# Altium schematic sheet Sheet1.SchDoc
size A0; SheetNumber: 1; SheetTotal: 1
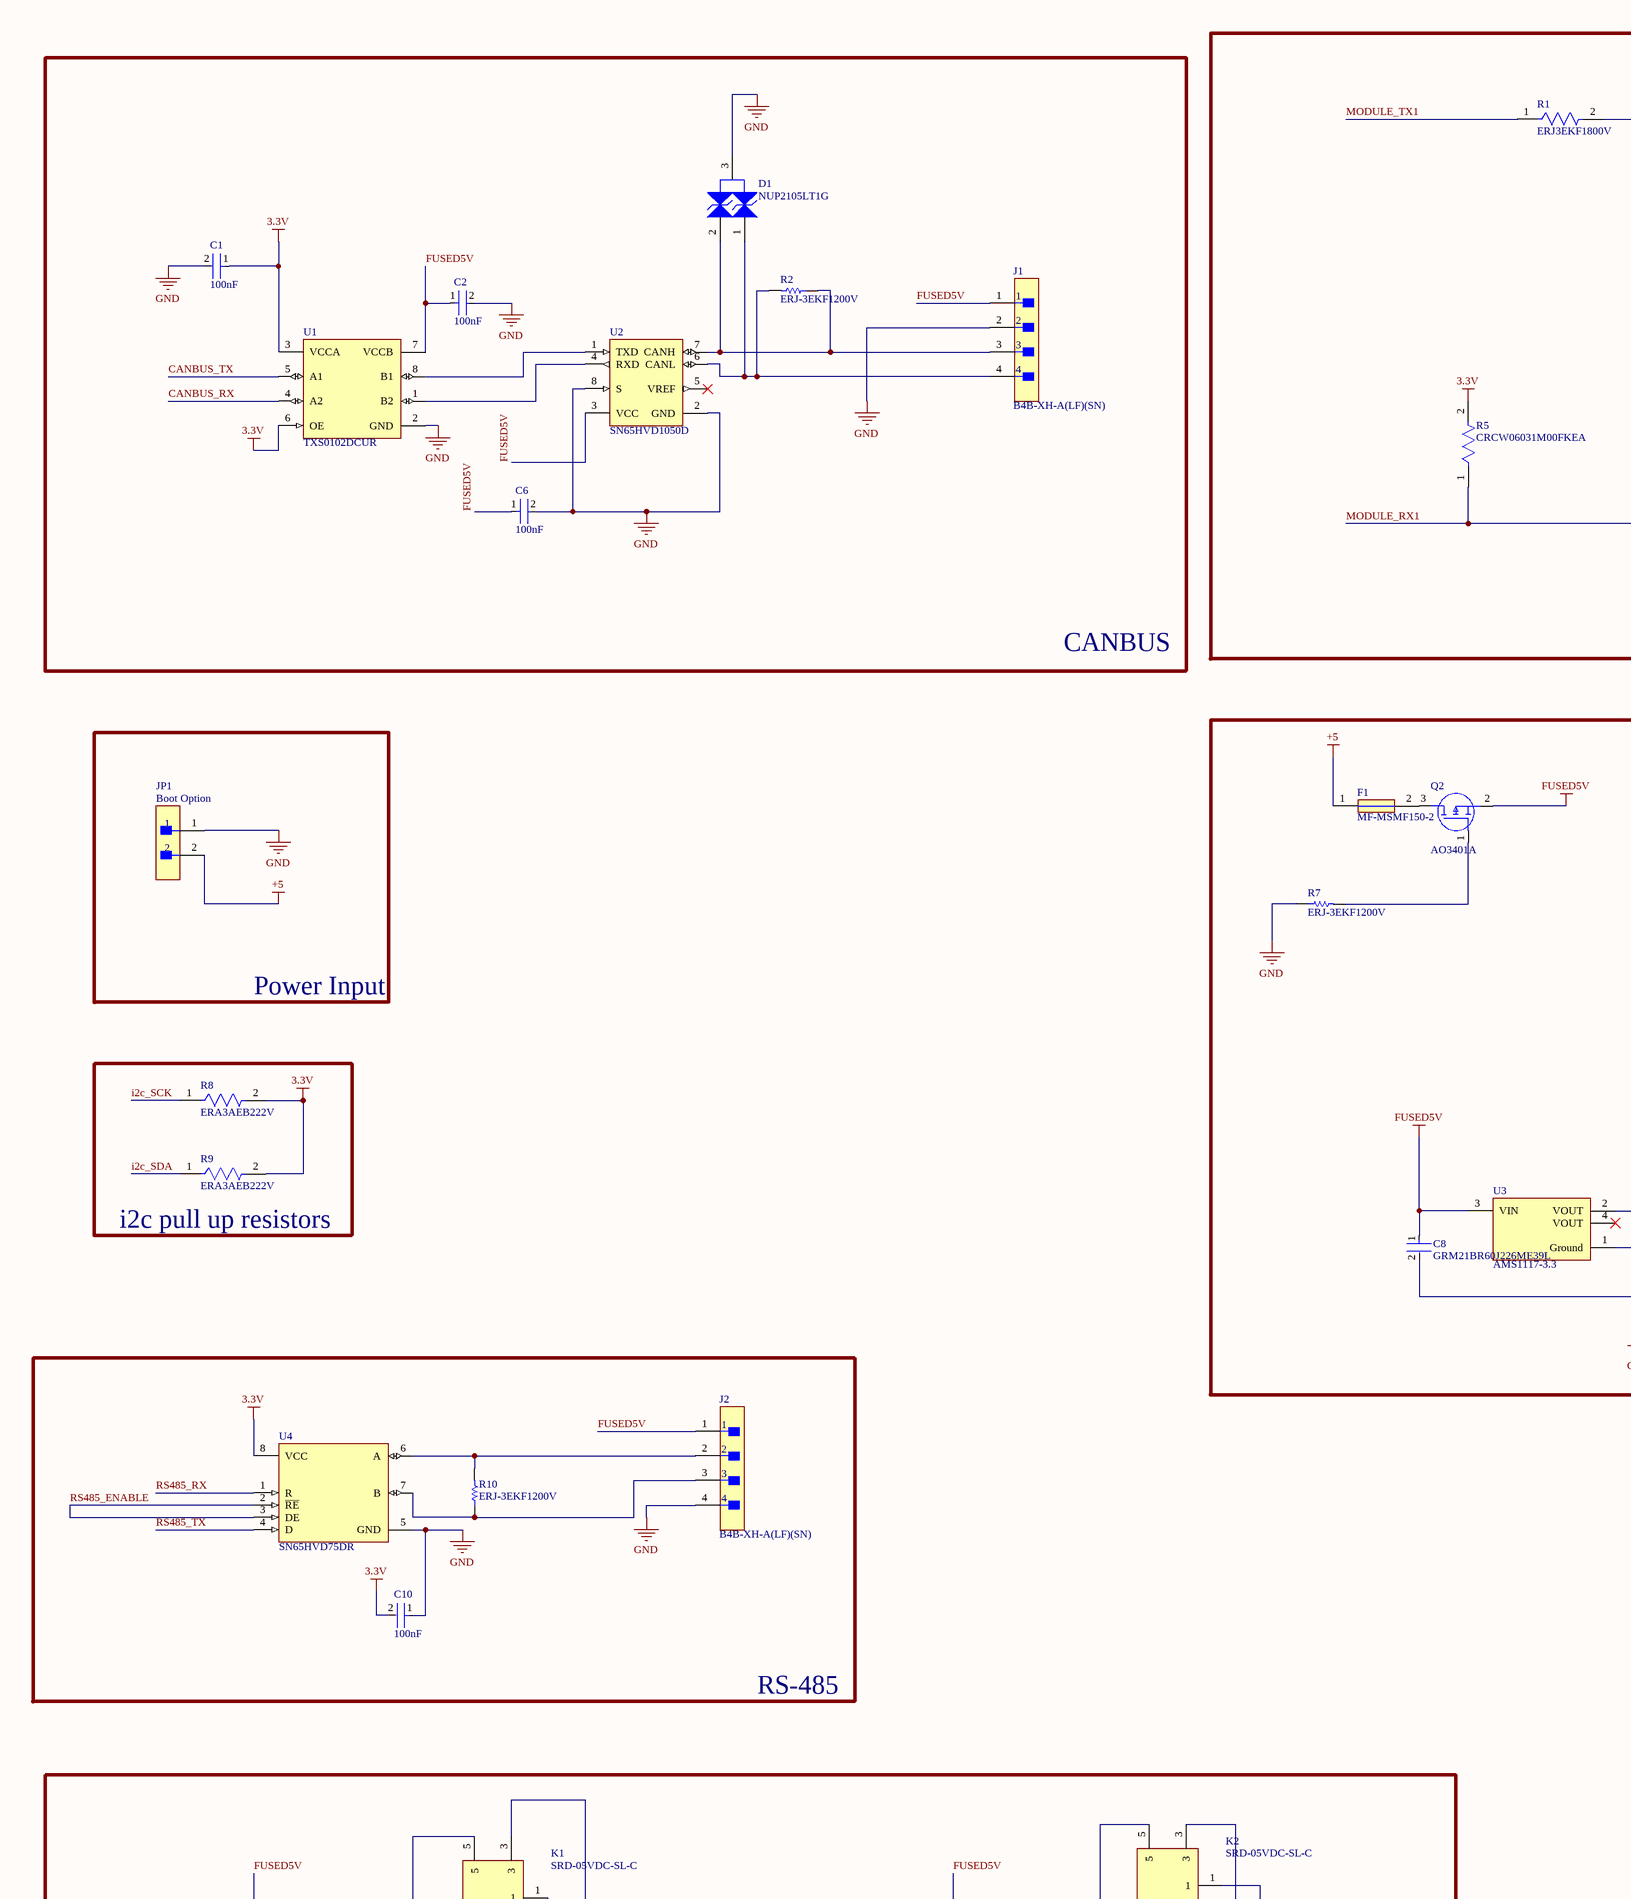
[diagram p0: Sheet1.SchDoc, top left]
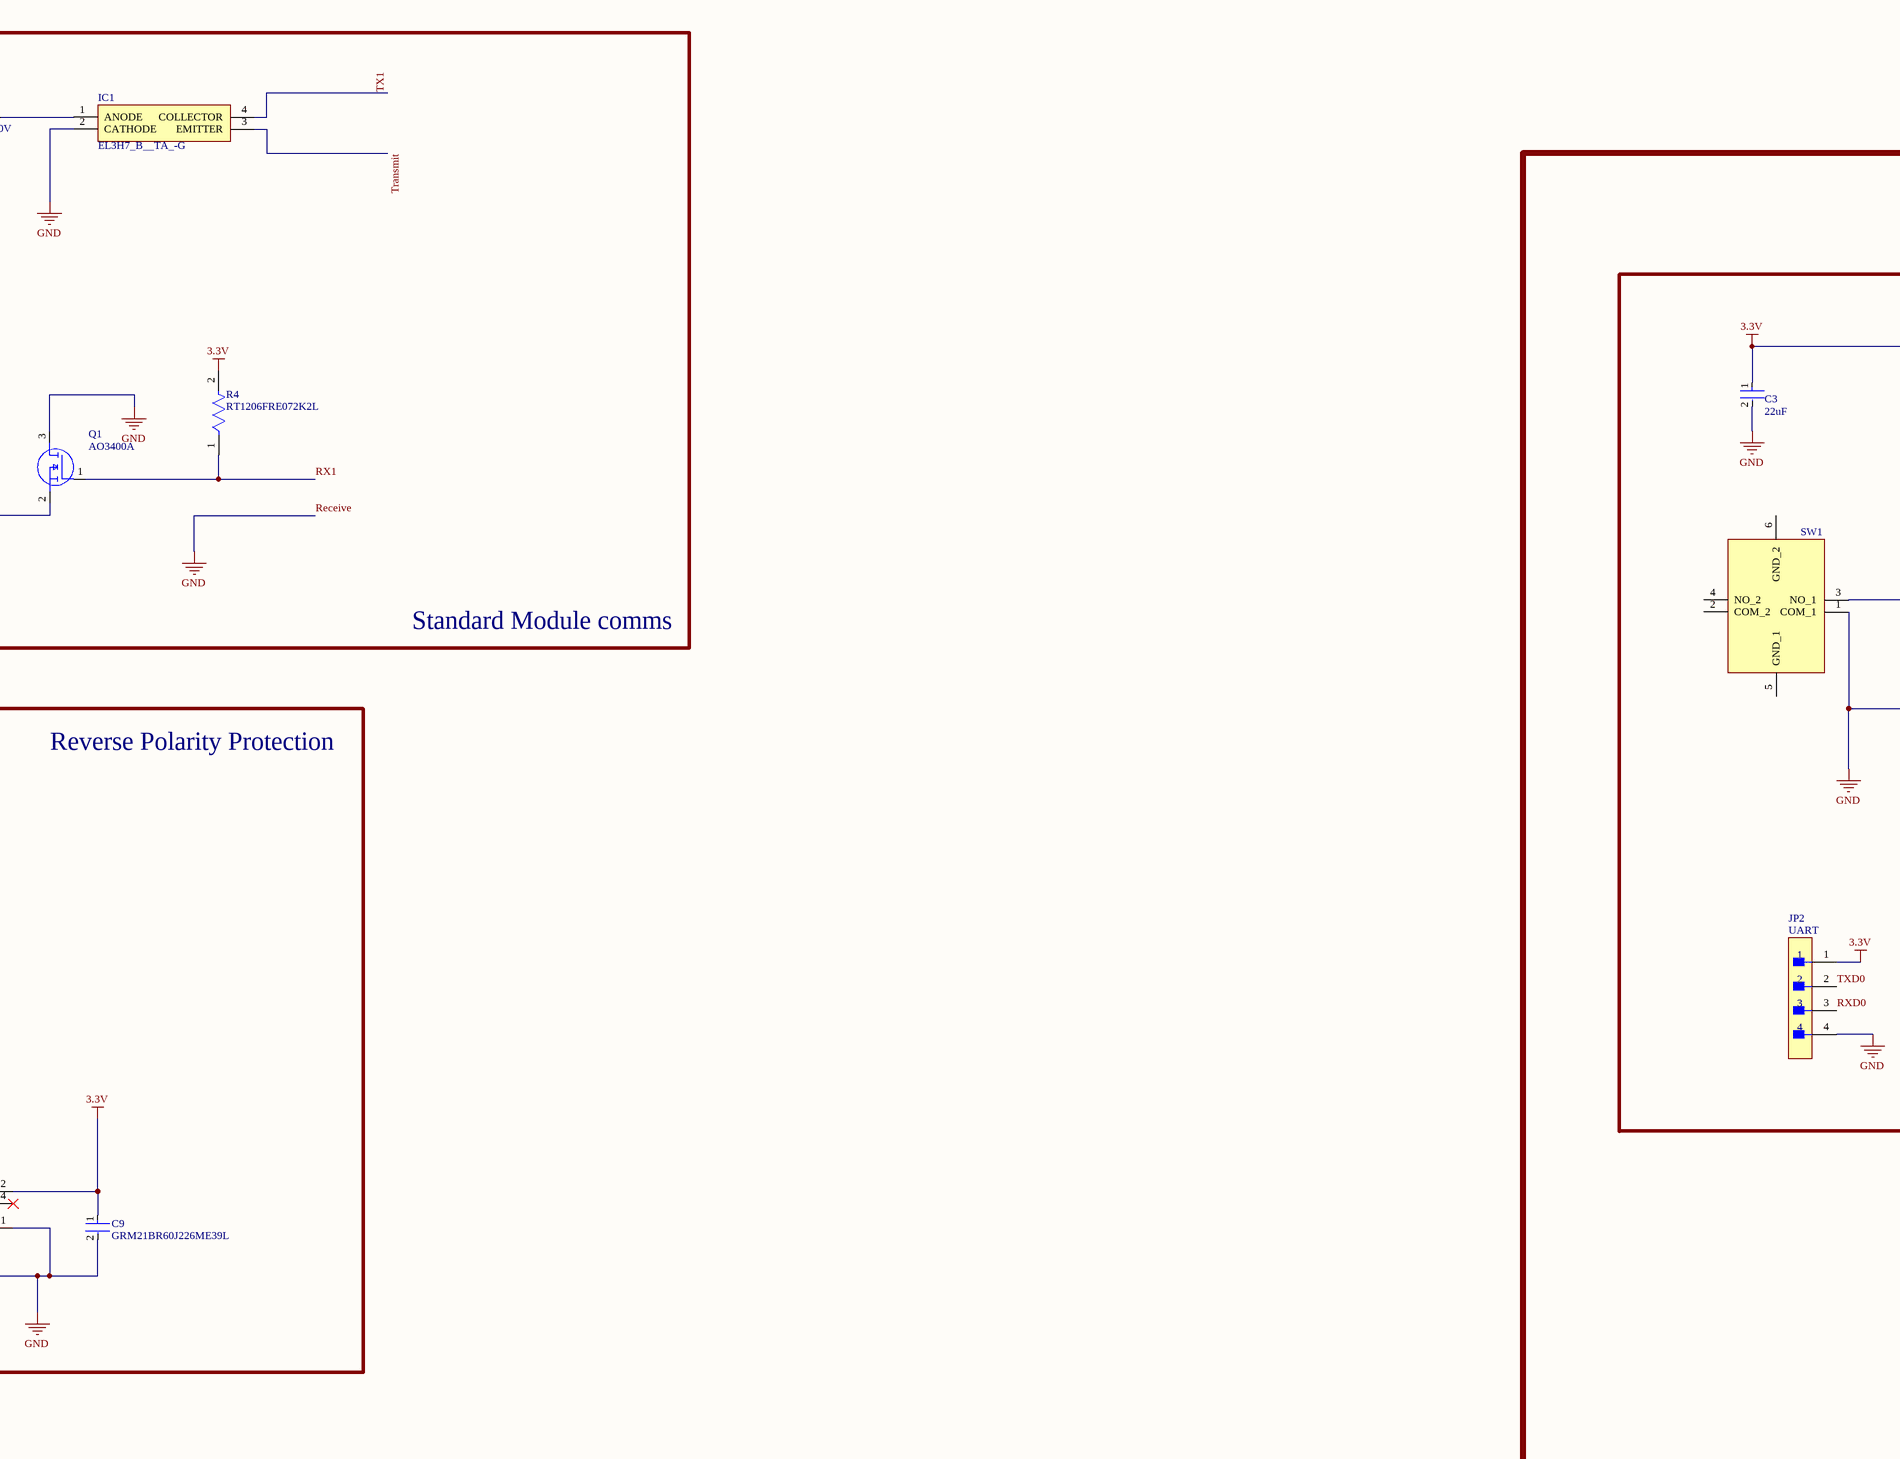
[diagram p1: Sheet1.SchDoc, top middle]
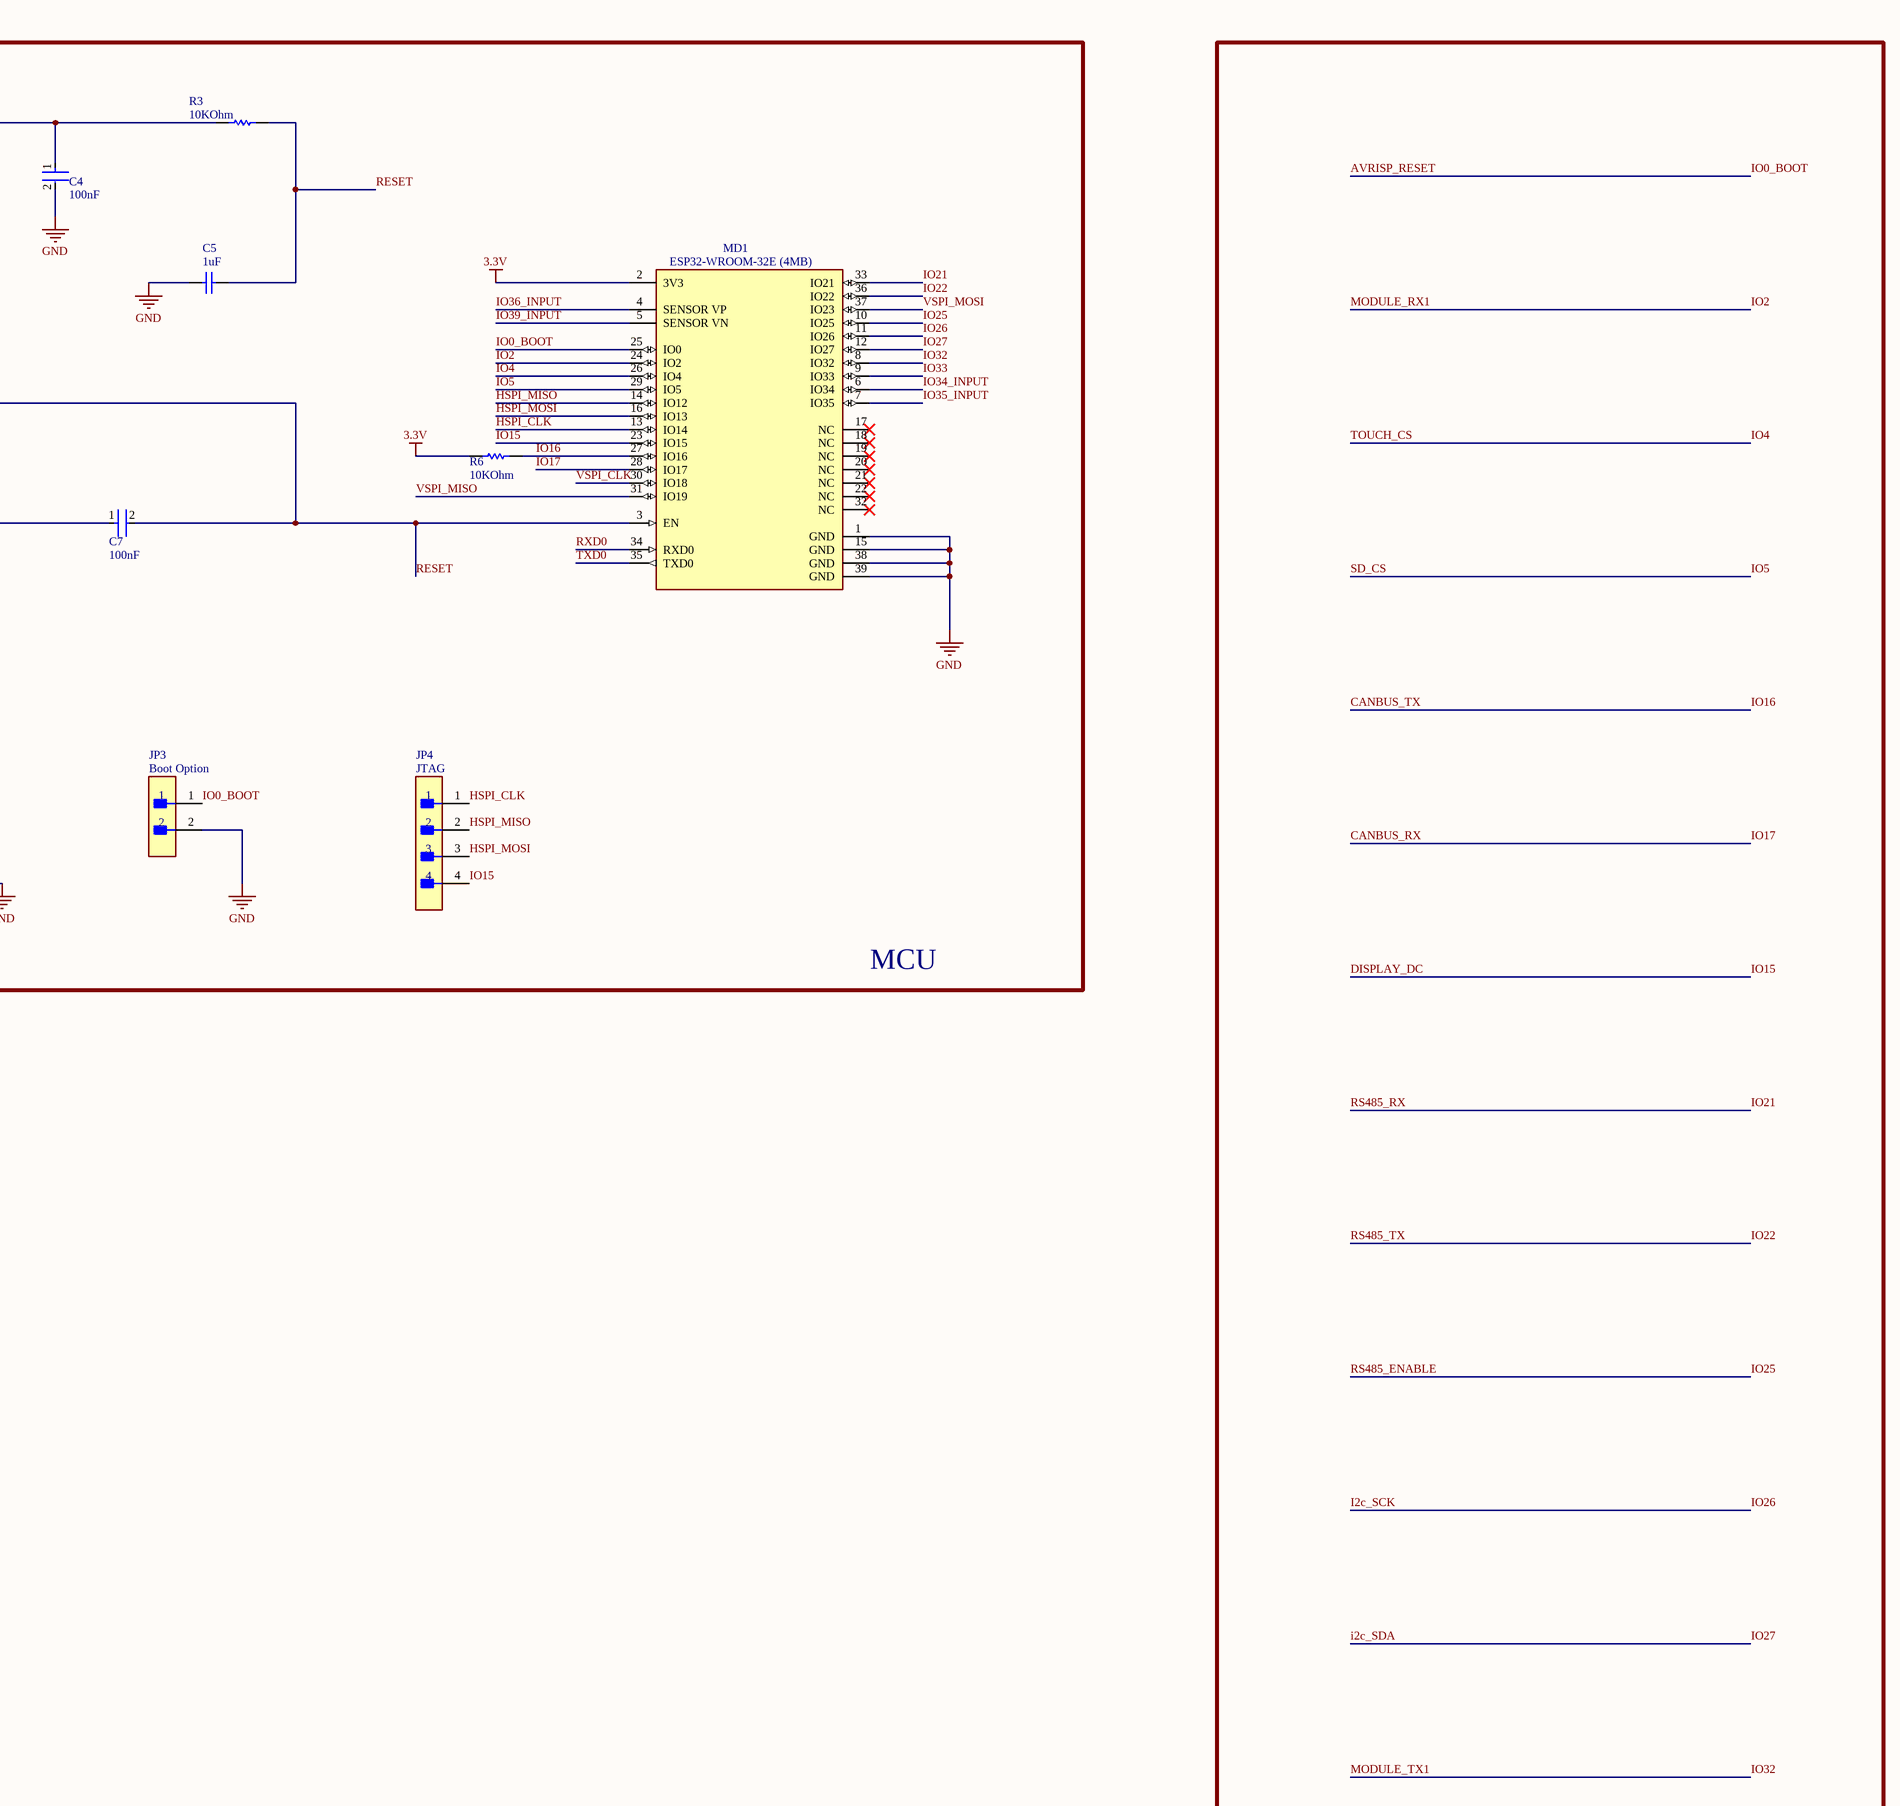
[diagram p2: Sheet1.SchDoc, top right]
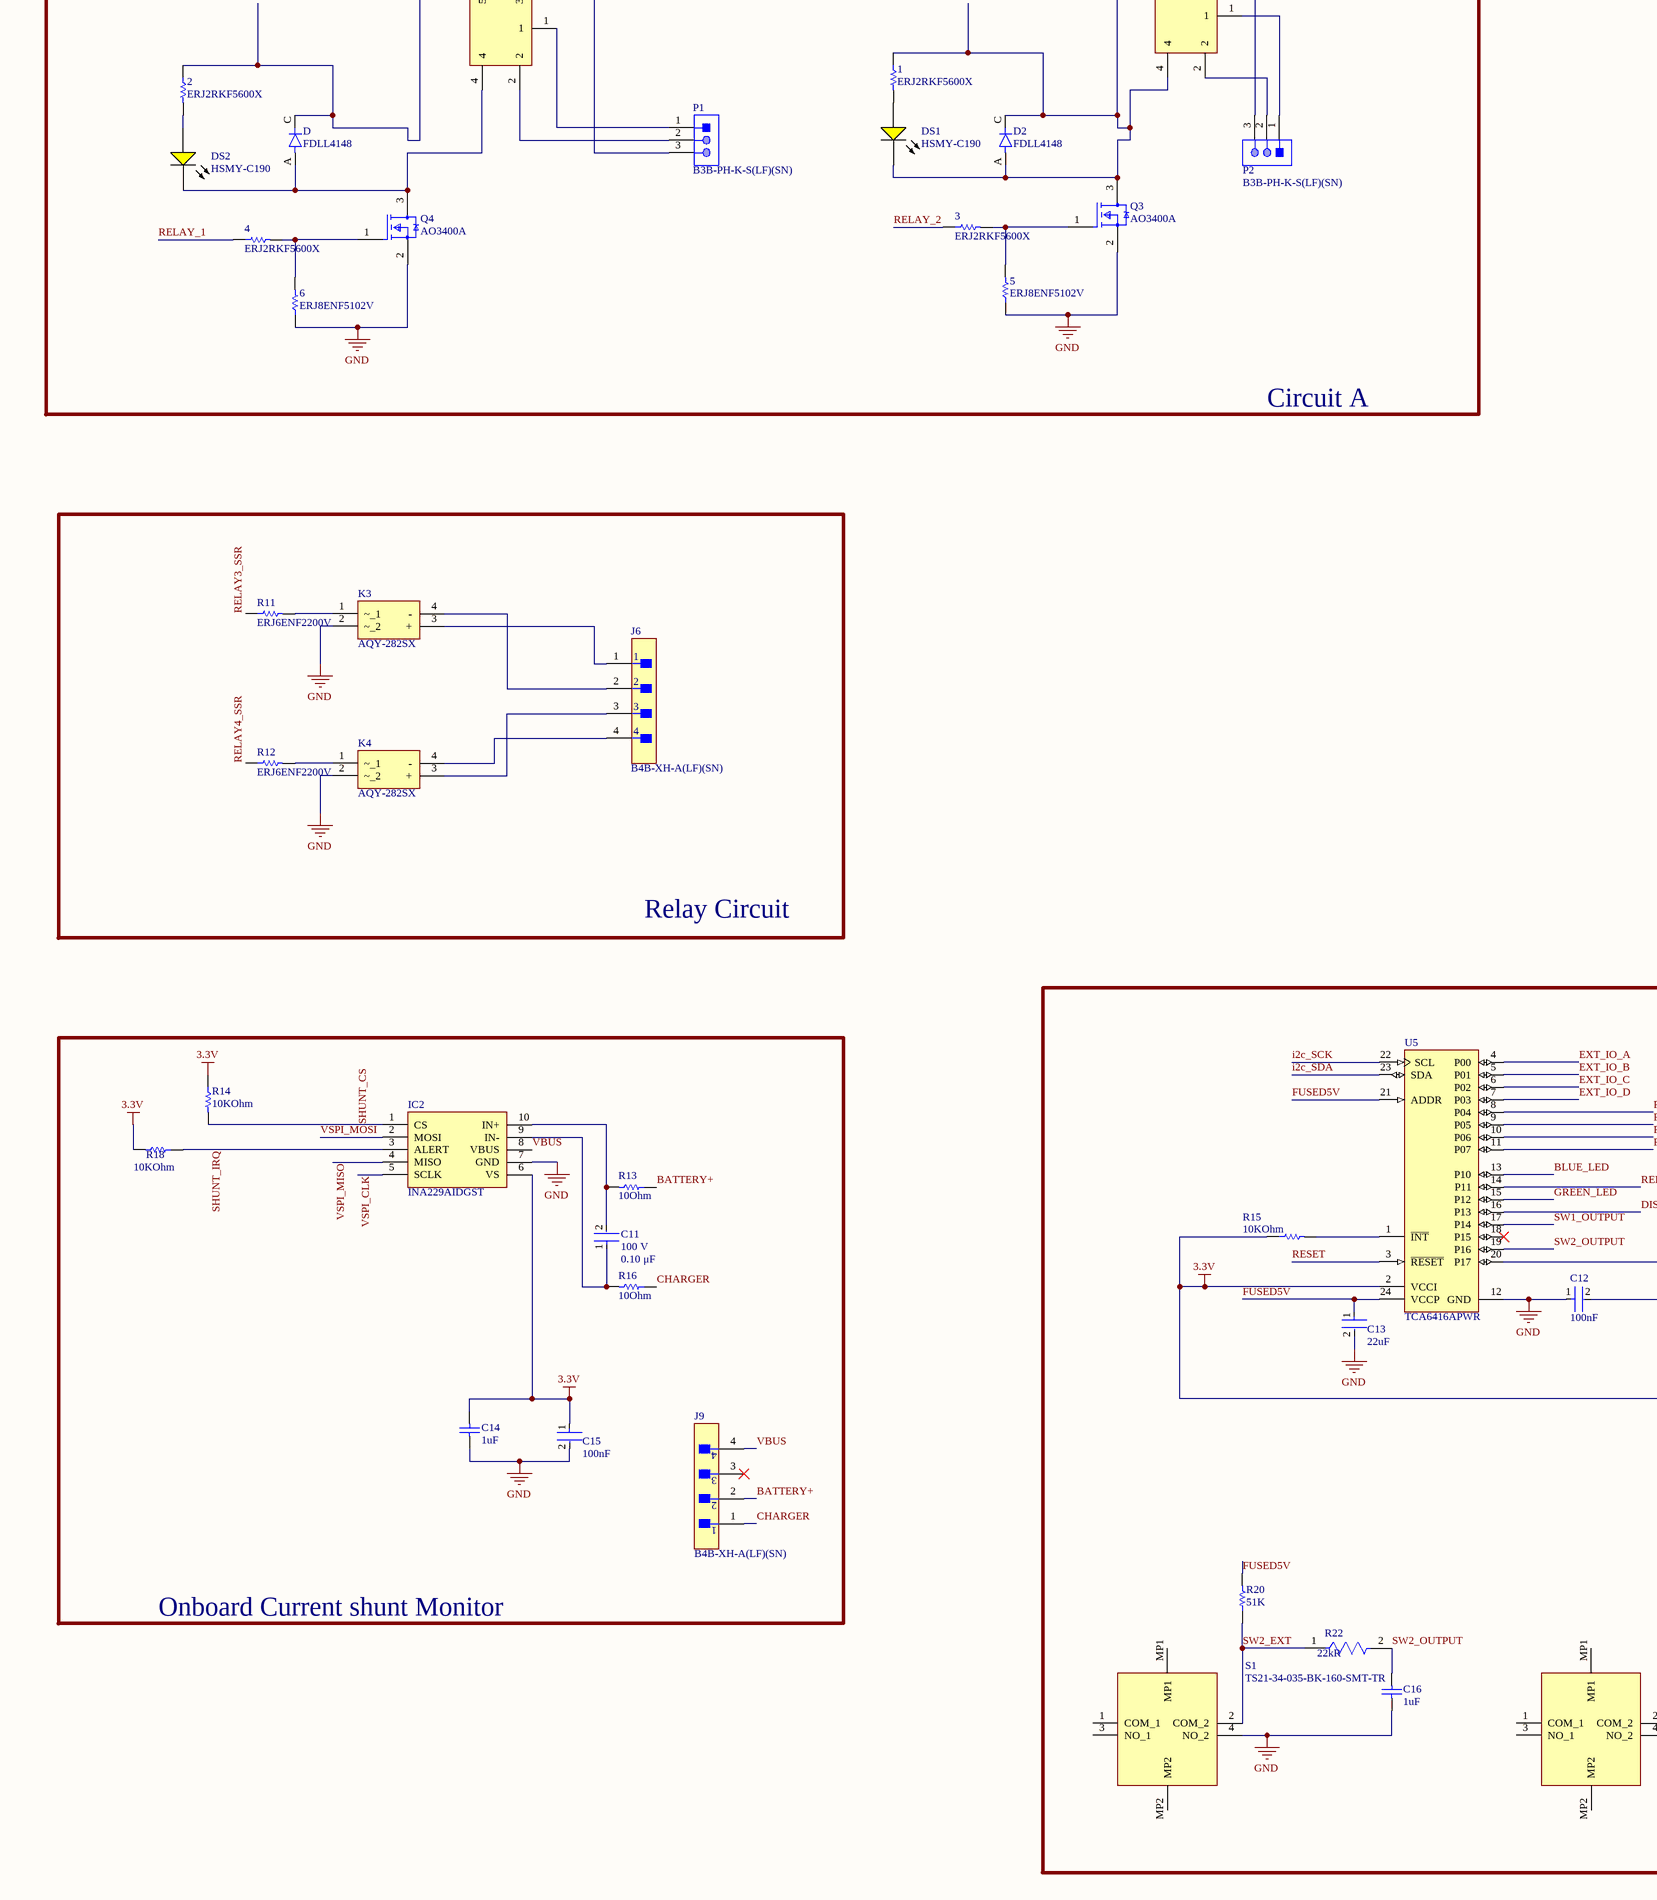
[diagram p3: Sheet1.SchDoc, bottom left]
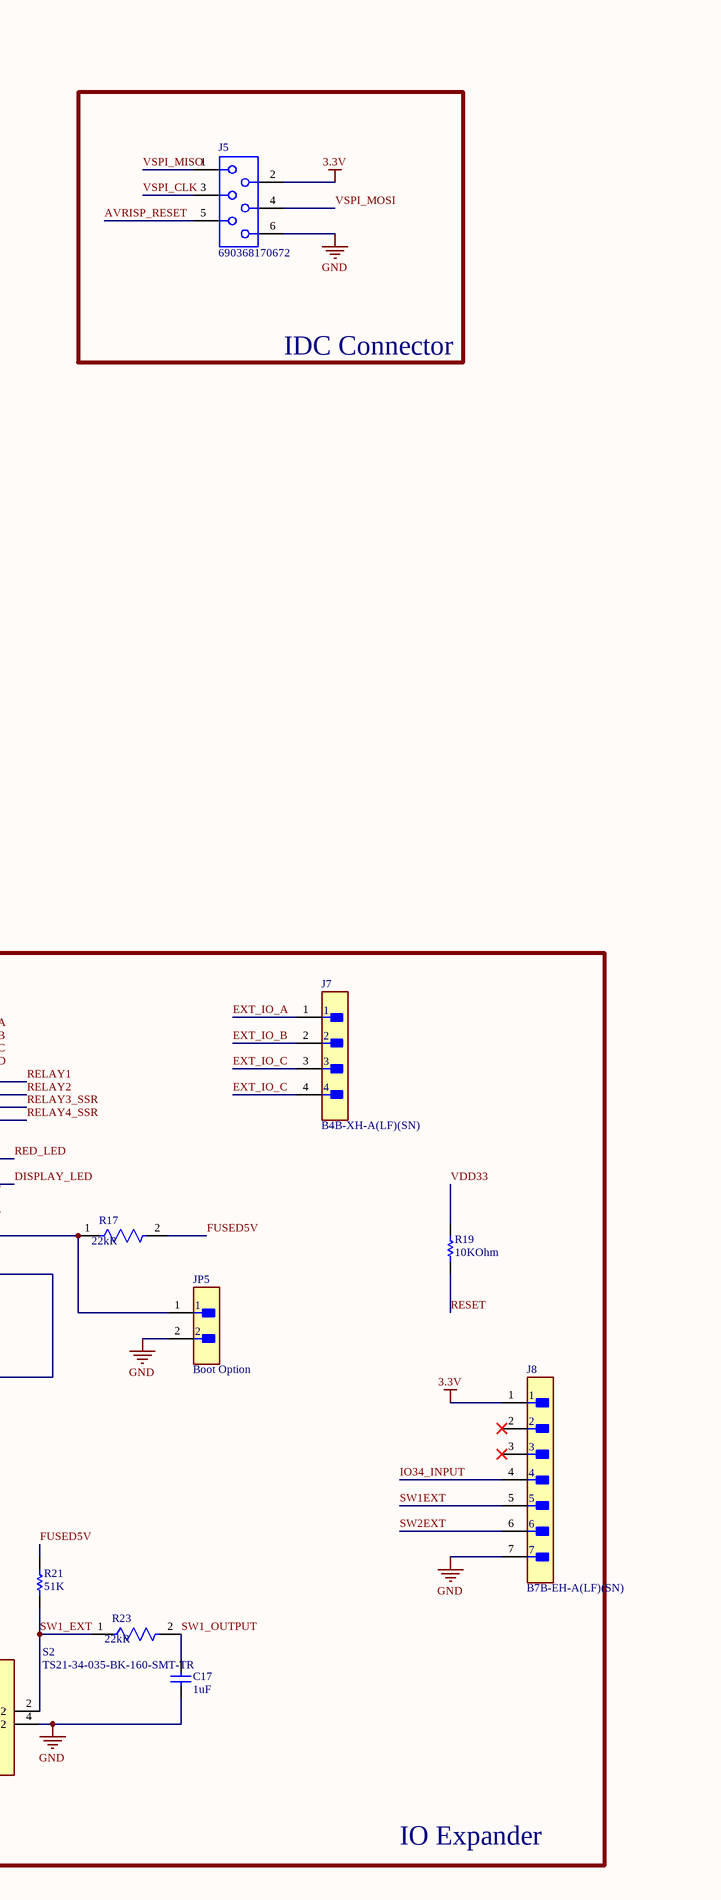
[diagram p4: Sheet1.SchDoc, bottom middle]
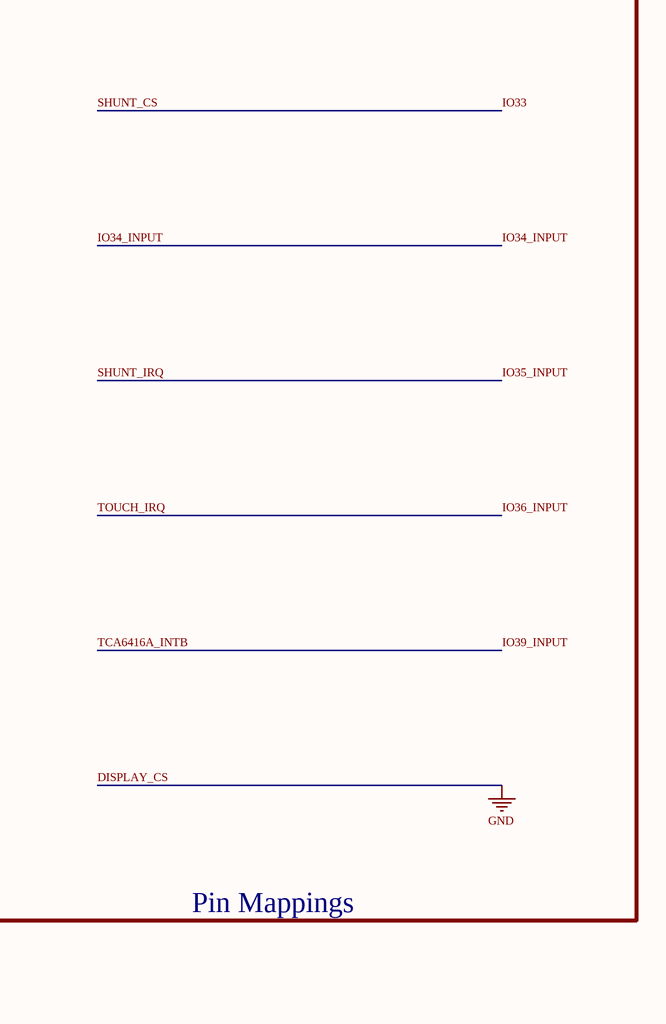
[diagram p5: Sheet1.SchDoc, bottom right]

## Parts
1  ERJ2RKF5600X  [RESC1005X40X25LL05T05]
2  ERJ2RKF5600X  [RESC1005X40X25LL05T05]
3  ERJ2RKF5600X  [RESC1005X40X25LL05T05]
4  ERJ2RKF5600X  [RESC1005X40X25LL05T05]
5  ERJ8ENF5102V  [RESC3216X70X50NL05T20]
6  ERJ8ENF5102V  [RESC3216X70X50NL05T20]
C1  Capacitance: 100nF  [FP-GRM033-0_03-IPC_C]  (hidden comment: GRM033R61A104KE15D)
C2  Capacitance: 100nF  [FP-GRM033-0_03-IPC_C]  (hidden comment: GRM033R61A104KE15D)
C3  Capacitance: 22uF  [FP-GRM21B-0_15-MFG]  (hidden comment: GRM21BR60J226ME39L)
C4  Capacitance: 100nF  [FP-GRM033-0_03-IPC_C]  (hidden comment: GRM033R61A104KE15D)
C5  Capacitance: 1uF  [CAPC2013X145X50LL20T25]  (hidden comment: C0805C105K4PACTU)
C6  Capacitance: 100nF  [FP-GRM033-0_03-IPC_C]  (hidden comment: GRM033R61A104KE15D)
C7  Capacitance: 100nF  [FP-GRM033-0_03-IPC_C]  (hidden comment: GRM033R61A104KE15D)
C8  GRM21BR60J226ME39L  [FP-GRM21B-0_15-MFG]
C9  GRM21BR60J226ME39L  [FP-GRM21B-0_15-MFG]
C10  Capacitance: 100nF  [FP-GRM033-0_03-IPC_C]  (hidden comment: GRM033R61A104KE15D)
C11  Voltage Rating: 100 V  Capacitance: 0.10 μF  [FP-C1206C-EB-MFG]  (hidden comment: C1206C104K1RACTU)
C12  Capacitance: 100nF  [FP-GRM033-0_03-IPC_C]  (hidden comment: GRM033R61A104KE15D)
C13  Capacitance: 22uF  [FP-GRM21B-0_15-MFG]  (hidden comment: GRM21BR60J226ME39L)
C14  Capacitance: 1uF  [CAPC2013X145X50LL20T25]  (hidden comment: C0805C105K4PACTU)
C15  Capacitance: 100nF  [FP-GRM033-0_03-IPC_C]  (hidden comment: GRM033R61A104KE15D)
C16  Capacitance: 1uF  [CAPC2013X145X50LL20T25]  (hidden comment: C0805C105K4PACTU)
C17  Capacitance: 1uF  [CAPC2013X145X50LL20T25]  (hidden comment: C0805C105K4PACTU)
D  FDLL4148  [DIOMELF3414N]
D1  NUP2105LT1G  [ONSC-SOT-23-3-318-08_V]
D2  FDLL4148  [DIOMELF3414N]
DS1  HSMY-C190  [AVAG-HSMX-C190_V]
DS2  HSMY-C190  [AVAG-HSMX-C190_V]
F1  MF-MSMF150-2  [FUSC4632X85N]
IC1  EL3H7_B__TA_-G  [SOIC127P700X200-4N]
IC2  INA229AIDGST  [SOP50P490X110-10N]
J1  B4B-XH-A(LF)(SN)  [FP-B4B-XH-A_LF_SN-MFG]
J2  B4B-XH-A(LF)(SN)  [FP-B4B-XH-A_LF_SN-MFG]
J5  690368170672  [690368170672]
J6  B4B-XH-A(LF)(SN)  [FP-B4B-XH-A_LF_SN-MFG]
J7  B4B-XH-A(LF)(SN)  [FP-B4B-XH-A_LF_SN-MFG]
J8  B7B-EH-A(LF)(SN)  [FP-B7B-EH-A_LF_SN-MFG]
J9  B4B-XH-A(LF)(SN)  [FP-B4B-XH-A_LF_SN-MFG]
JP1  Purpose: Boot Option  [FP-B2B-XH-A_LF_SN-MFG]  (hidden comment: B2B-XH-A(LF)(SN))
JP2  Purpose: UART  [FP-B4B-XH-A_LF_SN-MFG]  (hidden comment: B4B-XH-A(LF)(SN))
JP3  Purpose: Boot Option  [FP-B2B-XH-A_LF_SN-MFG]  (hidden comment: B2B-XH-A(LF)(SN))
JP4  Purpose: JTAG  [FP-B4B-XH-A_LF_SN-MFG]  (hidden comment: B4B-XH-A(LF)(SN))
JP5  Purpose: Boot Option  [FP-B2B-XH-A_LF_SN-MFG]  (hidden comment: B2B-XH-A(LF)(SN))
K1  SRD-05VDC-SL-C  [SRD]
K2  SRD-05VDC-SL-C  [SRD]
K3  AQY-282SX  [SOP254P680X230-4N]
K4  AQY-282SX  [SOP254P680X230-4N]
MD1  ESP32-WROOM-32E (4MB)  [FP-ESP32-WROOM-32E_4MB-MFG]
P1  B3B-PH-K-S(LF)(SN)  [JST-B3B-PH-K-S-3_V]
P2  B3B-PH-K-S(LF)(SN)  [JST-B3B-PH-K-S-3_V]
Q1  AO3400A  [SOT95P280X125-3N]
Q2  AO3401A  [SOT95P280X125-3N]
Q3  AO3400A  [FP-SOT23-MFG]
Q4  AO3400A  [FP-SOT23-MFG]
R1  ERJ3EKF1800V  [FP-ERJ3EK-MFG]
R2  ERJ-3EKF1200V  [RESC1609X55X30ML15T15]
R3  Resistance: 10KOhm  [RESC1005X40X25LL05T05]  (hidden comment: ERJ2RKF1002X)
R4  RT1206FRE072K2L  [FP-RT1206-MFG]
R5  CRCW06031M00FKEA  [FP-CRCW0603-e3-IPC_A]
R6  Resistance: 10KOhm  [RESC1005X40X25LL05T05]  (hidden comment: ERJ2RKF1002X)
R7  ERJ-3EKF1200V  [RESC1609X55X30ML15T15]
R8  ERA3AEB222V  [FP-ERA3A-IPC_B]
R9  ERA3AEB222V  [FP-ERA3A-IPC_B]
R10  ERJ-3EKF1200V  [RESC1609X55X30ML15T15]
R11  ERJ6ENF2200V  [RESC2013X70X40NL20T20]
R12  ERJ6ENF2200V  [RESC2013X70X40NL20T20]
R13  Resistance: 10Ohm  [RESC3225X70X50LL20T20]  (hidden comment: ERJ-14NF10R0U)
R14  Resistance: 10KOhm  [RESC1005X40X25LL05T05]  (hidden comment: ERJ2RKF1002X)
R15  Resistance: 10KOhm  [RESC1005X40X25LL05T05]  (hidden comment: ERJ2RKF1002X)
R16  Resistance: 10Ohm  [RESC3225X70X50LL20T20]  (hidden comment: ERJ-14NF10R0U)
R17  Resistance: 22kR  [FP-ERA3A-MFG]  (hidden comment: ERA-3AEB223V)
R18  Resistance: 10KOhm  [RESC1005X40X25LL05T05]  (hidden comment: ERJ2RKF1002X)
R19  Resistance: 10KOhm  [RESC1005X40X25LL05T05]  (hidden comment: ERJ2RKF1002X)
R20  Resistance: 51K  [RESC1608X55X30NL15T15]  (hidden comment: ERJ-3GEYJ513V)
R21  Resistance: 51K  [RESC1608X55X30NL15T15]  (hidden comment: ERJ-3GEYJ513V)
R22  Resistance: 22kR  [FP-ERA3A-MFG]  (hidden comment: ERA-3AEB223V)
R23  Resistance: 22kR  [FP-ERA3A-MFG]  (hidden comment: ERA-3AEB223V)
S1  TS21-34-035-BK-160-SMT-TR  [TS2134035BK160SMTTR]
S2  TS21-34-035-BK-160-SMT-TR  [TS2134035BK160SMTTR]
SW1  PTS526SMG20SMTR21_LFS  [PTS526SMG20SMTR21LFS]  (value not drawn)
U1  TXS0102DCUR  [FP-DCU0008A-MFG]
U2  SN65HVD1050D  [D0008A_N]
U3  AMS1117-3.3  [FP-AMS1117-IPC_C]
U4  SN65HVD75DR  [FP-D0008A-MFG]
U5  TCA6416APWR  [PW0024A_L]

## Blocks framed on the sheet
Standard Module comms: IC1 Q1 R1 R4 R5
CANBUS: C1 C2 C6 D1 J1 R2 U1 U2
MCU: C3-C5 C7 JP2-JP4 MD1 R3 R6 SW1
Reverse Polarity Protection: C8 C9 F1 Q2 R7 U3
Power Input: JP1
i2c pull up resistors: R8 R9
RS-485: C10 J2 R10 U4
Circuit A: 1-6 D D2 DS1 DS2 K1 K2 P1 P2 Q3 Q4
IDC Connector: J5
Relay Circuit: J6 K3 K4 R11 R12
IO Expander: C12 C13 C16 C17 J7 J8 JP5 R15 R17 R19-R23 S1 S2 U5
Onboard Current shunt Monitor: C11 C14 C15 IC2 J9 R13 R14 R16 R18

## Nets
3.3V: C1.1 C3.1 C4.1 C9.1 C10.2 C12.2 C14.1 C15.1 IC2.6(VS) J5.2 J8.1 JP2.1 MD1.2(3V3) R3.1 R4.2 R5.2 R6.1 R8.2 R9.2 R14.1 R15.1 R18.2 U1.3(VCCA) U1.6(OE) U3.2(VOUT) U4.8(VCC) U5.2(VCCI)
+5: F1.1 JP1.2
DISPLAY_CS: 5.1 6.1 C1.2 C2.2 C3.2 C4.2 C5.1 C6.2 C7.1 C8.2 C9.2 C10.1 C12.1 C13.2 C14.2 C15.2 C16.2 C17.2 D1.3(K) IC1.2(CATHODE) IC2.7(GND) J1.2 J2.4 J5.6 J8.7 JP1.1 JP2.4 JP3.2 JP5.2 K3.2(~_2) K4.2(~_2) MD1.1(GND) MD1.15(GND) MD1.38(GND) MD1.39(GND) Q1.3(D) Q3.2(S) Q4.2(S) R7.1 S1.4(NO_2) S2.4(NO_2) SW1.1(COM_1) U1.2(GND) U2.2(GND) U2.8(S) U3.1(Ground) U4.5(GND) U5.12(GND)  [also labelled GND, Receive]
FUSED5V: 1.1 2.1 C2.1 C6.1 C8.1 C13.1 D.C D2.A D2.C DS1.2(K) J1.1 J2.1 K1.5 K2.4 K2.5 Q2.2(S) Q3.3(D) R17.2 R20.2 R21.2 U1.7(VCCB) U2.3(VCC) U3.3(VIN) U5.21(ADDR) U5.24(VCCP)
AVRISP_RESET: J5.5 JP3.1 MD1.25(IO0)  [also labelled IO0_BOOT]
BATTERY+: J9.2 R13.1
BLUE_LED: U5.13(P10)
CANBUS_RX: MD1.28(IO17) U1.4(A2)  [also labelled IO17]
CANBUS_TX: MD1.27(IO16) R6.2 U1.5(A1)  [also labelled IO16]
CHARGER: J9.1 R16.1
DISPLAY_DC: JP4.4 MD1.23(IO15)  [also labelled IO15]
DISPLAY_LED: U5.16(P13)
EXT_IO_A: J7.1 U5.4(P00)
EXT_IO_B: J7.2 U5.5(P01)
EXT_IO_C: J7.3 J7.4 U5.6(P02)
EXT_IO_D: U5.7(P03)
GREEN_LED: U5.15(P12)
HSPI_CLK: JP4.1 MD1.13(IO14)
HSPI_MISO: JP4.2 MD1.14(IO12)
HSPI_MOSI: JP4.3 MD1.16(IO13)
i2c_SCK: MD1.11(IO26) R8.1 U5.22(SCL)  [also labelled IO26]
i2c_SDA: MD1.12(IO27) R9.1 U5.23(SDA)  [also labelled IO27]
IO2: MD1.24(IO2) Q1.2(S) R5.1  [also labelled MODULE_RX1]
IO4: MD1.26(IO4)  [also labelled TOUCH_CS]
IO5: MD1.29(IO5)  [also labelled SD_CS]
IO21: MD1.33(IO21) U4.1(R)  [also labelled RS485_RX]
IO22: MD1.36(IO22) U4.4(D)  [also labelled RS485_TX]
IO25: MD1.10(IO25) U4.2(~{RE}) U4.3(DE)  [also labelled RS485_ENABLE]
IO32: MD1.8(IO32) R1.1  [also labelled MODULE_TX1]
IO33: IC2.1(CS) MD1.9(IO33) R14.2  [also labelled SHUNT_CS]
IO34_INPUT: J8.4 MD1.6(IO34)
IO35_INPUT: IC2.3(ALERT) MD1.7(IO35) R18.1  [also labelled SHUNT_IRQ]
IO36_INPUT: MD1.4(SENSOR_VP)  [also labelled TOUCH_IRQ]
IO39_INPUT: MD1.5(SENSOR_VN)  [also labelled TCA6416A_INTB]
RED_LED: U5.14(P11)
RELAY1: U5.8(P04)
RELAY2: U5.9(P05)
RELAY3_SSR: R11.1 U5.10(P06)
RELAY4_SSR: R12.1 U5.11(P07)
RELAY_1: 4.1
RELAY_2: 3.1
RESET: C5.2 C7.2 MD1.3(EN) R3.2 R19.1 SW1.3(NO_1) U5.3(~{RESET})
RX1: Q1.1(G) R4.1
RXD0: JP2.3 MD1.34(RXD0)
SW1_EXT: R21.1 R23.1 S2.2(COM_2)
SW1_OUTPUT: C17.1 R23.2 U5.17(P14)
SW1EXT: J8.5
SW2_EXT: R20.1 R22.1 S1.2(COM_2)
SW2_OUTPUT: C16.1 R22.2 U5.19(P16)
SW2EXT: J8.6
Transmit: IC1.3(EMITTER)
TX1: IC1.4(COLLECTOR)
TXD0: JP2.2 MD1.35(TXD0)
VBUS: IC2.8(VBUS) J9.4
VDD33: R19.2
VSPI_CLK: IC2.5(SCLK) J5.3 MD1.30(IO18)
VSPI_MISO: IC2.4(MISO) J5.1 MD1.31(IO19)
VSPI_MOSI: IC2.2(MOSI) J5.4 MD1.37(IO23)
Net1_2: 1.2 DS1.1(A)
Net2_2: 2.2 DS2.1(A)
Net3_2: 3.2 5.2 Q3.1(G)
Net4_2: 4.2 6.2 Q4.1(G)
NetC11_1: C11.1 IC2.9(IN-) R16.2
NetC11_2: C11.2 IC2.10(IN+) R13.2
NetD1_1: D1.1(K) J1.4 R2.2 U2.6(CANL)
NetD1_2: D1.2(K) J1.3 R2.1 U2.7(CANH)
NetD_A: D.A DS2.2(K) K1.4 Q4.3(D)
NetF1_2: F1.2 Q2.3(D)
NetIC1_1: IC1.1(ANODE) R1.2
NetJ2_2: J2.2 R10.2 U4.6(A)
NetJ2_3: J2.3 R10.1 U4.7(B)
NetJ6_1: J6.1 K3.3(+)
NetJ6_2: J6.2 K3.4(-)
NetJ6_3: J6.3 K4.3(+)
NetJ6_4: J6.4 K4.4(-)
NetJP5_1: JP5.1 R17.1 U5.20(P17)
NetK1_1: K1.1 P1.1
NetK1_2: K1.2 P1.2
NetK1_3: K1.3 P1.3
NetK2_1: K2.1 P2.1
NetK2_2: K2.2 P2.2
NetK2_3: K2.3 P2.3
NetK3_1: K3.1(~_1) R11.2
NetK4_1: K4.1(~_1) R12.2
NetQ2_1: Q2.1(G) R7.2
NetR15_2: R15.2 U5.1(~{INT})
NetU1_1: U1.1(B2) U2.4(RXD)
NetU1_8: U1.8(B1) U2.1(TXD)

Not connected (* = marked no-connect by the designer): J8 2* 3*; J9 3*; MD1 17(NC)* 18(NC)* 19(NC)* 20(NC)* 21(NC)* 22(NC)* 32(NC)*; S1 1(COM_1) 3(NO_1) MP1 MP2; S2 1(COM_1) 3(NO_1) MP1 MP2; SW1 2(COM_2) 4(NO_2) 5(GND_1) 6(GND_2); U2 5(VREF)*; U3 4(VOUT)*; U5 18(P15)*

## Notes on the sheet
- Pin Mappings

## Library data of the parts
1-4 = CMP-2002-01159-2: Chip Resistor, 560 Ohm, +/- 1%, 0.1 W, -55 to 155 degC, 0402 (1005 Metric), RoHS, Tape and Reel; Resistance: 560 Ohm; Voltage Rating: 50 V; Power Rating: 100 mW; Case\Package: 0402; Mounting Technology: Surface Mount; PackageDescription: 2-Pin Surface Mount Device, Body 1 x 0.5 mm; RoHSCompliant: true; ComponentLink1URL: http://www.panasonic.com/; Tolerance: 1%; REACH SVHC: Yes; Height: 0.35 mm; ComponentLink2Description: Datasheet; ComponentLink2URL: http://industrial.panasonic.com/cdbs/www-data/pdf/RDA0000/AOA0000C86.pdf; Radiation Hardening: No; Pins: 2; DatasheetVersion: 04/2015; Min Operating Temperature: -55 degC; Length: 1 mm; Case Code (Imperial): 0402; Packaging: Tape and Reel; Max Operating Temperature: 155 degC; ComponentLink1Description: Manufacturer URL; Mount: Surface Mount; Width: 0.5 mm; Case Code (Metric): 1005; Package Quantity: 10000; PackageReference: 0402
5 6 = CMP-2003-00854-1: Manufacturer: Panasonic; Part Number: ERJ8ENF5102V
C1 C2 C4 C6 C7 C10 C12 C15 = CMP-2010-01264-2: Chip Multilayer Ceramic Capacitors for General Purpose, 0201, 0.10uF, X5R, 15%, 10%, 10V; Mount: Surface Mount; Dielectric: X5R; Width: 0.012inch; Tolerance: 10%; Radiation Hardening: No; Voltage Rating: 10V; REACH SVHC: No SVHC; Height: 0.3mm; Max Operating Temperature: 85°C; Voltage Rating (DC): 10V; Thickness: 0.013inch; Termination: SMD/SMT; Lead Free: Lead Free; Package Quantity: 1; Case/Package: 0201; Min Operating Temperature: -55°C; Weight: 6E-06oz; Length: 0.6mm; Case Code (Imperial): 0201; Depth: 0.3mm; Voltage: 10V; Packaging: Tape and Reel; Case Code (Metric): 0603
C3 C8 C9 C13 = CMP-2007-03385-2: Chip Multilayer Ceramic Capacitors for General Purpose, 0805, 22uF, X5R, 15%, 20%, 6.3V; Material: Ceramic; Max Operating Temperature: 85°C; Voltage: 6.3V; Min Operating Temperature: -55°C; Case/Package: 0805; Thickness: 0.053inch; Dielectric: X5R; Packaging: Tape and Reel; Depth: 1.25mm; Termination: SMD/SMT; Voltage Rating (DC): 6.3V; Radiation Hardening: No; Tolerance: 20%; Mount: Surface Mount; Lead Free: Lead Free; Package Quantity: 1; REACH SVHC: No SVHC; Voltage Rating: 6.3V; Length: 2mm; Case Code (Imperial): 0805; Case Code (Metric): 2012; Width: 0.049inch; Height: 1.25mm
  C8 C9: Capacitance: 22uF
C5 C14 C16 C17 = CMP-1036-04746-2: Manufacturer: Kemet; Part Number: C0805C105K4PACTU
C11 = CMP-03020-000153-1: CAP CER 0.1UF 100V X7R 1206; Manufacturer: KEMET; Value: 0.10 μF; Tolerance: 0.1; Material: Ceramic; Temperature Coefficient: 15%; Automotive Grade: Grade 0; Automotive: Yes; Ipc Land Pattern Name: CAPC320160X78; Device Class L1: Passive Components; ComponentLink2Description: Datasheet; Temperature Range Low: -55°C; Category: Cap; Octopart: https://octopart.com/c1206c104k1ractu-kemet-89521; Height: 0.88mm; Lead Free: Yes; Digikey Description: CAP CER 0.1UF 100V X7R 1206; Mouser Description: CAP CER 0.1UF 100V X7R 1206; Device Class L3: Ceramic Capacitors; Device Class L2: Capacitors; ComponentLink2URL: https://content.kemet.com/datasheets/KEM_C1007_X8R_ULTRA_150C_SMD.pdf; Temperature Range High: +150°C; Temperature Characteristic: X7R; Manufacturer Part Number: C1206C104K1RACTU; RoHS: TRUE; Package: C1206C-EB; Temperature: -55°C to +150°C
D D2 = FDLL4148: Diode Standard 100V 200mA Surface Mount SOD-80; MF: ON Semiconductor; MP: FDLL4148; SnapEDA_Link: https://www.snapeda.com/parts/FDLL4148/ON%20Semiconductor/view-part/2783433/?ref=snap; Package: SOD-80-2 ON Semiconductor; DigiKey-Purchase-URL: https://snapeda.com/shop?store=DigiKey&id=2783433; Value: *; Mouser-Purchase-URL: https://snapeda.com/shop?store=Mouser&id=2783433; Digi-Key_Part_Number: FDLL4148CT-ND; Check_prices: https://www.snapeda.com/parts/FDLL4148/ON%20Semiconductor/view-part/2783433/?ref=eda
D1 = CMP-1063-00164-1: Dual Line CAN Bus Protector, 3-Pin SOT-23, Pb-Free, Tape and Reel; Manufacturer: On Semiconductor; IR Max (uA): 0.1; Number of Lines: 2; Direction: Bidirectional; C Max (pF): 30; PPK Max (W): 350; V(BR) Min (V): 26.2; ComponentLink3URL: http://www.onsemi.cn/pub_link/Collateral/318-08.PDF; Mounting Technology: Surface Mount; ComponentLink2Description: Datasheet; PartNumber: NUP2105LT1G; ComponentLink1URL: http://www.onsemi.com/; PackageVersion: Rev. AP, 11/2009; DatasheetVersion: Rev. 5; RoHS: Pb-Free; PackageReference: SOT-23-3-318-08; ComponentLink2URL: http://www.onsemi.cn/pub_link/Collateral/NUP2105L-D.PDF; ComponentLink1Description: Manufacturer URL; PackageDescription: 3-Pin Small Outline Transistor, Body 2.92 x 1.3 mm, Pitch 0.95 mm; Packing: Tape and Reel; ComponentLink3Description: Package Specification
DS1 DS2 = CMP-1744-00003-1: LED Uni-Color Yellow, 65 mW, 20 mA, -40 to 85 degC, 2-Pin SMD, RoHS, Tape and Reel; Tolerance: 1%; Voltage Rating: 50 V; Power Rating: 100 mW; Case\Package: 0603; Resistance: 390 Ohm; Min Operating Temperature: -55 degC; Length: 1.6 mm; ComponentLink3Description: Package Specification; Mount: Surface Mount; PackageReference: HSMX-C190; ComponentLink2Description: Datasheet; DatasheetVersion: Mar-12; Case Code (Metric): 1608; Pins: 2; Package Quantity: 5000; ComponentLink2URL: http://docs.avagotech.com/docs/AV02-0551EN; ComponentLink1Description: Manufacturer URL; RoHSCompliant: true; Packaging: Tape and Reel; PackageDescription: 2-Pin Surface Mount Device, Body 1.6 x 0.8 mm, Height 0.9 mm; REACH SVHC: No SVHC; ComponentLink3URL: http://www.fairchildsemi.com/dwg/MA/MA03D.pdf; Voltage Rating (DC): 50 V; Width: 0.8 mm; ComponentLink1URL: http://www.avagotech.com/; Max Operating Temperature: 155 degC; Case Code (Imperial): 0603; Height: 0.45 mm
F1 = MF-MSMF150-2: Fuse; Manufacturer_Name: Bourns; Datasheet Link: https://componentsearchengine.com/Datasheets/2/MF-MSMF150-2.pdf; Height: 0.85mm; Manufacturer_Part_Number: MF-MSMF150-2; Mouser Part Number: 652-MF-MSMF150-2; Mouser Price/Stock: https://www.mouser.co.uk/ProductDetail/Bourns/MF-MSMF150-2?qs=VJkZAnU6DY2RTCSZT8Bxqg%3D%3D; Arrow Part Number: MF-MSMF150-2; Arrow Price/Stock: https://www.arrow.com/en/products/mf-msmf150-2/bourns?region=nac
IC1 = EL3H7_B__TA_-G: Integrated Circuit; Manufacturer_Name: Everlight; Manufacturer_Part_Number: EL3H7(B)(TA)-G; Datasheet Link: https://www.arrow.com/en/products/el3h7-b-ta-g/everlight-electronics?region=nac; Height: 2mm; Mouser Part Number: 638-EL3H7BTAG; Mouser Price/Stock: https://www.mouser.co.uk/ProductDetail/Everlight/EL3H7BTA-G?qs=8PzhAHr7IdM%252B0XGOXhFFCg%3D%3D; Arrow Part Number: EL3H7(B)(TA)-G; Arrow Price/Stock: https://www.arrow.com/en/products/el3h7-b-ta-g/everlight-electronics?region=nac
IC2 = INA229AIDGST: Integrated Circuit; Manufacturer_Name: Texas Instruments; Datasheet Link: https://www.ti.com/lit/ds/symlink/ina229.pdf?ts=1623484017616&ref_url=https%253A%252F%252Fwww.google.com%252F; Height: 1.1mm; Manufacturer_Part_Number: INA229AIDGST; Mouser Part Number: 595-INA229AIDGST; Mouser Price/Stock: https://www.mouser.co.uk/ProductDetail/Texas-Instruments/INA229AIDGST?qs=eP2BKZSCXI5pgVbVXaUSbg%3D%3D
J1 J2 J6 J7 J9 JP2 JP4 = CMP-17439-000250-1: CONN HEADER VERT 4POS 2.5MM; Number of Contacts: 4; Contact Resistance: 20mR; Voltage Rating: 250V; Max Current Rating: 3A; Gender: Male; Wire/Cable Gauge: 22AWG; Mated Stacking Heights: 9.8mm; Insulation Resistance: 1GR; Orientation: Straight; Contact Type: Male Pin; Contact Finish - Mating: TIN; Series: XH; Max Voltage Rating (AC): 250V; Lead Pitch: 2.5mm; Contact Shape: Square; Insulation Color: Natural; Termination: Solder; Lead Free: Lead Free; Voltage Rating (AC): 250V; Number of Rows: 1; Flammability Rating: UL94 V-0; Number of Positions: 4; Max Operating Temperature: 85°C; Package Quantity: 500; Mount: Through Hole; REACH SVHC: No SVHC; Connector Type: Header; Insulation Material: Nylon; Fastening Type: Detent; Min Operating Temperature: -25°C; Housing Color: White; Packaging: Bulk; Contact Plating: Tin; Contact Material: Brass; Max Voltage Rating (DC): 250V; Housing Material: Polyamide; Color: Natural; Material: Polyamide; Pitch: 2.5mm; Depth: 5.75mm; Current Rating: 3A; Length: 12.4mm
J5 = CMP-1502-00866-2: NexarPartId: 8917642; Connector Type: Receptacle, Socket; Gender: Female; Contact Resistance: 10mΩ; Insulation Resistance: 1GΩ; Number of Positions: 6; Pitch: 2.54mm; Voltage Rating: 100V; Row Spacing: 1.4986mm; Insulation: Insulated; Current Rating: 1.5A; Orientation: Straight; Insulation Material: PBT; RoHS: Compliant; Lead Pitch: 2.54mm; Housing Material: PBT; Termination: Through Hole; Contact Plating: Tin; Flammability Rating: UL94 V-0; Length: 9.62mm; Height: 5.8mm; Number of Rows: 2; Min Operating Temperature: -40°C; Number of Contacts: 6; Color: Red; Operating Supply Voltage: 100V; Mount: Through Hole; Max Operating Temperature: 105°C; Contact Material: Bronze; REACH SVHC: Unknown; Number of Pins: 6; Contact Gender: Female
J8 = CMP-17439-000532-1: CONN HEADER VERT 7POS 2.5MM; Number of Contacts: 7; Mated Stacking Heights: 8.1mm; Gender: Male; Current Rating: 3A; Voltage Rating: 250V; Termination: Solder; Contact Material: Brass; Connector Type: Header; Flammability Rating: UL94 V-0; Housing Material: Nylon; Series: EH; Fastening Type: Friction; Lead Free: Lead Free; Insulation Color: Natural; Contact Type: Male Pin; Number of Rows: 1; Packaging: Bulk; Color: Natural; Contact Finish - Mating: TIN; Orientation: Straight; Contact Shape: Square; Contact Plating: Tin; Insulation Material: Nylon; Housing Color: White; Mount: Through Hole; Contact Mating Length: 0.13inch; Pitch: 2.5mm; Number of Positions: 7
JP1 JP3 JP5 = CMP-2000-05888-3: CONN HEADER VERT 2POS 2.5MM; Current Rating: 3A; Voltage Rating: 250V; Number of Contacts: 2; Contact Resistance: 20mR; Wire/Cable Gauge: 22AWG; Insulation Resistance: 1GR; Connector Type: Male Pin; Packaging: Bulk; Contact Material: Brass; Lead Free: Lead Free; Orientation: Straight; Contact Plating: Tin; Max Current Rating: 3A; Termination: Solder; Fastening Type: Detent; Depth: 5.75mm; Housing Material: Polyamide; REACH SVHC: No SVHC; Series: XH; Voltage Rating (AC): 250V; Number of Positions: 2; Color: Natural; Contact Type: Male Pin; Max Voltage Rating (DC): 250V; Pitch: 2.5mm; Lead Pitch: 2.5mm; Mount: Through Hole; Max Operating Temperature: 85°C; Length: 7.4mm; Max Voltage Rating (AC): 250V; Min Operating Temperature: -25°C; Number of Rows: 1; Housing Color: White
K1 K2 = SRD-05VDC-SL-C: Relay or Contactor; Manufacturer_Name: Songle Relay; Datasheet Link: http://files.microjpm.webnode.com/200001010-dda41de9e1/Songle%20Relay%20Datasheet.pdf; Manufacturer_Part_Number: SRD-05VDC-SL-C
K3 K4 = AQY-282SX: Relay or Contactor; Manufacturer_Name: Panasonic; Datasheet Link: https://componentsearchengine.com/Datasheets/2/AQY282SX.pdf; Height: 2.3mm; Manufacturer_Part_Number: AQY-282SX
MD1 = CMP-194065-000026-1: RX TXRX MOD WIFI TRACE ANT SMD
P1 P2 = CMP-2000-05164-1: Male Header, Pitch 2 mm, 1 x 3 Position, Height 6 mm, Tail Length 3.4 mm, -25 to 85 degC, RoHS, Bulk; Manufacturer: JST; Style/Orientation: StraightHeader/Plug; Pitch: 2mm; No of Positions: 3; Termination: Crimp; Manufacturer URL: http://www.jst.com/home2.html; Datasheet Version: Oct-06; Type: ShroudedHeader; Datasheet URL: https://datasheet.ciiva.com/11746/0900766b80826550-11746939.pdf
Q1 = AO3400A: MOSFET (N-Channel); Manufacturer_Name: Alpha & Omega Semiconductors; Datasheet Link: http://aosmd.com/res/data_sheets/AO3400A.pdf; Height: 1.25mm; Manufacturer_Part_Number: AO3400A; Arrow Part Number: AO3400A; Arrow Price/Stock: https://www.arrow.com/en/products/ao3400a/alpha-and-omega-semiconductor?region=europe
Q2 = AO3401A: MOSFET (P-Channel); Manufacturer_Name: Alpha & Omega Semiconductors; Datasheet Link: http://www.aosmd.com/pdfs/datasheet/AO3401A.pdf; Height: 1.25mm; Manufacturer_Part_Number: AO3401A; Arrow Part Number: AO3401A; Arrow Price/Stock: https://www.arrow.com/en/products/ao3401a/alpha-and-omega-semiconductor?region=nac
Q3 Q4 = CMP-83955-000006-1: MOSFET N-CH 30V 5.7A SOT23; Input Capacitance: 630pF; Number of Elements: 1; Rds On Max: 26.5mR; Max Power Dissipation: 1.4W; Gate to Source Voltage (Vgs): 12V; Min Operating Temperature: -55°C; Lead Free: Lead Free; Number of Pins: 3; Drain to Source Voltage (Vdss): 30V; Case/Package: SOT-23; Mount: Surface Mount; Continuous Drain Current (ID): 5.7A; Radiation Hardening: No; Packaging: Tape and Reel; Max Operating Temperature: 150°C; Power Dissipation: 1.4W
R1 = CMP-2000-00293-2: RES SMD 180 OHM 1% 1/10W 0603; Manufacturer: Panasonic; Value: 180Ω; Power Rating: 0.1W; Temperature Coefficient: 100ppm/°C; Voltage Rating: 75V; Automotive Grade: Grade 0; Digikey Description: RES SMD 180 OHM 1% 1/10W 0603; Series: ERJ; Octopart: https://octopart.com/erj-3ekf1800v-panasonic-55421532; Footprint Url: https://industrial.panasonic.com/cdbs/www-data/pdf/RDA0000/DMA0000COL17.pdf; Temperature: -55°C to +155°C; ComponentLink2Description: Datasheet; Device Class L3: Chip SMD Resistors; Temperature Range High: +155°C; RoHS: TRUE; Category: Res; Device Class L2: Resistors; Package: ERJ3EK; Mouser Description: Thick Film Resistors 0603 180ohms 1% AEC-Q200; Manufacturer Part Number: ERJ3EKF1800V; Resistance: 180Ω; Temperature Range Low: -55°C; Device Class L1: Passive Components; Automotive: Yes; ComponentLink2URL: https://industrial.panasonic.com/cdbs/www-data/pdf/RDA0000/AOA0000C304.pdf; Tolerance: 1%; Lead Free: Yes; Composition: Thick Film; Height: 0.55mm
R2 R7 R10 = CMP-2000-00213-2: Chip Resistor, 120 Ohm, +/- 1%, 0.1 W, -55 to 155 degC, 0603 (1608 Metric), RoHS, Tape and Reel; Manufacturer: Panasonic; Power Rating: 100mW; Voltage Rating (DC): 75V; Resistance: 120Ohm; Temperature Coefficient: 100ppm/degreesC; Number of Terminations: 2; Military Standard: Not; Tolerance: 1%; Min Operating Temperature: -55degC; Packaging: TapeandReel; Lead Free: LeadFree; Max Operating Temperature: 155degC; Manufacturer URL: http://www.panasonic.com/; Case Code (Imperial): 0603; REACH SVHC: NoSVHC; Width: 0.031inch; Datasheet URL: https://industrial.panasonic.com/cdbs/www-data/pdf/RDA0000/AOA0000C283.pdf; RoHSCompliant: true; Max Power Dissipation: 100mW; Termination: SMD/SMT; Package Reference: 0603; Height: 0.022inch; Depth: 0.8mm; Package Description: 2-Pin Surface Mount Device, Body 1.6 x 0.85 mm; Contact Plating: Tin; Length: 1.6mm; Package URL: http://www.st.com/st-web-ui/static/active/en/resource/technical/document/datasheet/CD00001320.pdf; Radiation Hardening: No; Package Quantity: 1; Number of Pins: 2; Datasheet Version: 42095.0; Voltage Rating: 75V; Composition: ThickFilm; Case/Package: 0603; Mount: SurfaceMount; Case Code (Metric): 1608
R3 R6 R14 R15 R18 R19 = CMP-2000-07588-1: Chip Resistor, 10 KOhm, +/- 1%, 0.1 W, -55 to 155 degC, 0402 (1005 Metric), RoHS, Tape and Reel; Manufacturer: Panasonic; Power Rating: 100mW; Voltage Rating: 50V; Case\/Package: 0402; Temperature Coefficient: 100ppm\/degreesC; RoHSCompliant: True; Lead Free: LeadFree; Package Quantity: 1; Contact Plating: Tin; Length: 1mm; Radiation Hardening: No; REACH SVHC: NoSVHC; Max Operating Temperature: 155degC; Depth: 0.5mm; Case Code (Imperial): 0402; Military Standard: Not; Package Description: 2-Pin Surface Mount Device, Body 1 x 0.5 mm; Termination: SMD/SMT; Case Code (Metric): 1005; Height: 0.35mm; Packaging: TapeandReel; Voltage Rating (DC): 50V; Package Reference: 402; Number of Pins: 2; Tolerance: 1%; Mounting Technology: SurfaceMount; Width: 0.02inch; Mount: SurfaceMount; Datasheet URL: https://industrial.panasonic.com/cdbs/www-data/pdf/RDA0000/AOA0000C304.pdf; Composition: ThickFilm; Datasheet Version: 02/2017; Manufacturer URL: http://www.panasonic.com/; Max Power Dissipation: 100mW; Number of Terminations: 2; Min Operating Temperature: -55degC
R4 = CMP-2003-04309-2: RES SMD 2.2K OHM 1% 1/4W 1206; Manufacturer: Yageo; Power Rating: 0.25W; Resistance: 2.2KΩ; Tolerance: 0.0002; Temperature Coefficient: 50 ppm/°C; Value: 2.2KΩ; Voltage Rating: 200V; Device Class L3: Chip SMD Resistors; Temperature: -55°C to +155°C; Digikey Description: RES SMD 2.2K OHM 1% 1/4W 1206; Height: 0.65mm; Manufacturer Part Number: RT1206FRE072K2L; ComponentLink2URL: http://www.yageo.com/documents/recent/PYu-RT_1-to-0.01_RoHS_L_9.pdf; Device Class L1: Passive Components; Ipc Land Pattern Name: RESC310160X55; Octopart: https://octopart.com/rt1206fre072k2l-yageo-1275907; Device Class L2: Resistors; Series: RT; Automotive: No; Temperature Range Low: -55°C; RoHS: TRUE; Category: Res; Temperature Range High: +155°C; ComponentLink2Description: Datasheet; Package: RT1206; Lead Free: Yes; Footprint Url: http://www.yageo.com/exep/pages/download/literatures/PYu-R_Mount_10.pdf; Mouser Description: High Precision-High Stability Chip Resistor Thin Film 1206 2.2kOhm 1% Paper T/R; Composition: Thin Film
R5 = CMP-2000-03013-2: RES Thick Film, 1MΩ, 1%, 0.1W, 100ppm/°C, 0603; Max Power Dissipation: 100mW; Resistance: 1MR; Voltage Rating (DC): 75V; Depth: 0.85mm; Max Operating Temperature: 155°C; Length: 1.55mm; Power Rating: 100mW; Military Standard: Not; Features: Automotive AEC-Q200; Min Operating Temperature: -55°C; Number of Pins: 2; Mount: Surface Mount; Package Quantity: 10; Packaging: Tape and Reel; Height: 0.45mm; Radiation Hardening: No; Case Code (Metric): 1608; Temperature Coefficient: 100ppm/°C; Width: 0.85mm; Composition: Thick Film; Termination: SMD/SMT; Tolerance: 1%; Number of Terminations: 2; Lead Free: Lead Free; Contact Plating: Tin; Case/Package: 0603; Weight: 7.1E-05oz; Voltage Rating: 75V; Case Code (Imperial): 0603
R8 R9 = CMP-2000-00955-7: RES SMD 2.2K OHM 0.1% 1/10W 0603; Power Rating: 100mW; Resistance: 2.2kR; Voltage Rating (DC): 75V; Temperature Coefficient: 25ppm/°C; Case/Package: 0603; Number of Pins: 2; Length: 1.6mm; Width: 0.8mm; RoHS Compliant: Yes; Lead Free: Lead Free; Radiation Hardening: No; Mount: Surface Mount; Max Power Dissipation: 100mW; Package Quantity: 5000; Height: 0.45mm; Series: ERA-3A; Reach SVHC Compliant: Yes; Features: Automotive AEC-Q200; Case Code (Imperial): 0603; Packaging: Tape and Reel; Construction: Rectangular; Case Code (Metric): 1608; Technology: METAL FILM; Ratings: AEC-Q200; Termination: SMD/SMT; Max Operating Temperature: 155°C; Depth: 0.8mm; Resistor Type: Thin Film; Tolerance: 0.1%; Military Standard: Not; Resistance Tolerance: 0.1%; Contact Plating: Tin; Number of Terminations: 2; Min Operating Temperature: -55°C; Size Code: 0603; Voltage Rating: 75V
R11 R12 = CMP-2001-00044-1: Manufacturer: Panasonic; Part Number: ERJ6ENF2200V
R13 R16 = CMP-1015-00284-2: Manufacturer: Panasonic; Part Number: ERJ-14NF10R0U
R17 R22 R23 = CMP-2000-00956-2: RES SMD 22K OHM 0.1% 1/10W 0603; Temperature Coefficient: 25ppm/°C; Voltage Rating (DC): 75V; Max Power Dissipation: 100mW; Mount: Surface Mount; Length: 1.6mm; Height: 0.45mm; Case/Package: 0603; Depth: 0.8mm; Number of Pins: 2; Width: 0.8mm; Resistance Tolerance: 0.1%; Construction: Rectangular; RoHS Compliant: Yes; Tolerance: 0.1%; Case Code (Metric): 1608; Power Rating: 100mW; Number of Terminations: 2; REACH SVHC: No SVHC; Radiation Hardening: No; Max Operating Temperature: 155°C; Lead Free: Lead Free; Resistor Type: Thin Film; Technology: THIN FILM; Termination: Solder; Packaging: Tape and Reel; Min Operating Temperature: -55°C; Contact Plating: Tin; Voltage Rating: 75V; Military Standard: Not; Series: ERA-3A; Package Quantity: 1; Size Code: 0603; Case Code (Imperial): 0603; Features: Automotive AEC-Q200
R20 R21 = CMP-2000-00804-1: Manufacturer: Panasonic; Part Number: ERJ-3GEYJ513V
S1 S2 = TS21-34-035-BK-160-SMT-TR: Switch; Manufacturer_Name: CUI Devices; Datasheet Link: https://www.cuidevices.com/product/resource/ts21.pdf; Height: 1.7mm; Manufacturer_Part_Number: TS21-34-035-BK-160-SMT-TR; Mouser Part Number: 179-134035BK160SMTTR; Mouser Price/Stock: https://www.mouser.co.uk/ProductDetail/CUI-Devices/TS21-34-035-BK-160-SMT-TR?qs=1Kr7Jg1SGW9zzGN58LP5Sg%3D%3D
SW1 = PTS526SMG20SMTR21_LFS: Switch; Manufacturer_Name: C & K COMPONENTS; Manufacturer_Part_Number: PTS526SMG20SMTR21 LFS; Datasheet Link: https://www.ckswitches.com/media/2780/pts526.pdf; Height: 2.15mm; Mouser Part Number: 611-PTS526SMG20S21LF; Mouser Price/Stock: https://www.mouser.co.uk/ProductDetail/CK/PTS526SMG20SMTR21-LFS?qs=MyNHzdoqoQLOqPcVU%2F1RhA%3D%3D; Arrow Part Number: PTS526SMG20SMTR21 LFS; Arrow Price/Stock: https://www.arrow.com/en/products/pts526smg20smtr21-lfs/ck?region=nac
U1 = CMP-0859-00001-2: IC TRNSLTR BIDIRECTIONAL US8; Manufacturer: Texas Instruments; Number Of Circuits: 1; Number Of Inputs: 2; Data Rate: 24Mbits/s; Max Junction Temp: +150°C; V A Min: 1.65V; Standoff Height: 0mm; Logic Function Desc: Bidirectional Voltage-Level Translator; Max Supply Voltage: 5.5V; V A Max: 3.6V; Nominal Supply Current: 1-14.4uA; V B Min: 2.3V; Temperature: -40°C to +85°C; Temperature Range Low: -40°C; Height: 0.9mm; Device Class L1: Integrated Circuits (ICs); RoHS: TRUE; Min Supply Voltage: 1.65V; Digikey Description: IC TRNSLTR BIDIRECTIONAL US8; ComponentLink2Description: Datasheet; Octopart: https://octopart.com/txs0102dcur-texas+instruments-5414308; Temperature Range High: +85°C; Device Class L2: Logic ICs; Category: IC; Ambient Temperature Range High: +85°C; Automotive: No; Manufacturer Part Number: TXS0102DCUR; Device Class L3: Voltage Level Shifters; Number Of Outputs: 2; Ambient Temperature Range Low: -40°C; Lead Free: Yes; ComponentLink2URL: http://www.ti.com/lit/ds/symlink/txs0102.pdf; V B Max: 5.5V; Package: DCU0008A; Mouser Description: Translation - Voltage Levels 2-Bit Bi-Directional Voltage-Level-Trans
U2 = CMP-0315-00048-2: High-Speed EMC Optimized CAN Transceiver, 70 mA, 5 V, -40 to 125 degC, 8-pin SOIC (D), Green (RoHS & no Sb/Br); Manufacturer: Texas Instruments; Bus Fault Voltage(V): -4 to 16; Rating: Catalog; Drivers Per Package: 1; Transient Pulse Protection(V): -200 to 200; ICC(Max)(mA): 70; Supply Voltage(s)(V): 5; PackageVersion: revM, Jun-2011; PartNumber: SN65HVD1050D; PackageReference: D0008A; Code_JEDEC: MS-012AA; Isolated: No; ComponentLink1Description: Datasheet; PackageDescription: 8-Pin Plastic Small Outline Integrated Circuit, 4.9 x 3.9 mm, Pitch 1.27 mm Pitch; Receivers Per Package: 1; Footprint: TJA1050; DatasheetVersion: SLLS632B; SubFamily: CAN; ComponentLink1URL: http://www.ti.com/general/docs/lit/getliterature.tsp?genericPartNumber=SN65HVD1050&fileType=pdf; Eco-Plan: Green (RoHS & no Sb/Br); Mounting Technology: Surface Mount
U3 = CMP-209535-000001-1: LDO Voltage Regulators 1A, 3.3V; Manufacturer: Advanced Monolithic Systems; Dropout Voltage: 1.1V; Output Type: Fixed; Nominal Supply Current: 5mA; Max Power Dissipation: 1.2W; Max Supply Voltage: 15V; Number Of Outputs: 1; Standoff Height: 0.64mm; Max Junction Temp: +125°C; Height: 1.8mm; Package: AMS1117; Device Class L2: Power Management ICs; ComponentLink2Description: Datasheet; ComponentLink2URL: http://www.advanced-monolithic.com/pdf/ds1117.pdf; Category: IC; RoHS: TRUE; Automotive: No; Device Class L1: Integrated Circuits (ICs); Output Current: 1A; Device Class L3: Voltage Regulators - Linear; Temperature: -40°C to +125°C; Output Voltage: 3.3V; Manufacturer Part Number: AMS1117-3.3; Temperature Range Low: -40°C; Octopart: https://octopart.com/ams1117-3.3-advanced+monolithic+systems-25899300; Lead Free: Yes; Ipc Land Pattern Name: SOT229P700X180-4; Temperature Range High: +125°C
U4 = CMP-0694-00003-3: IC TRANSCEIVER HALF 1/1 8SOIC; Max Supply Voltage: 3.6V; Number of Receivers: 1; Data Rate: 20Mbps; Operating Supply Voltage: 3.3V; Simplex/Duplex: Half Duplex; Receiver Hysteresis: 80mV; Interface: RS-422; Supply Current: 950uA; Min Supply Voltage: 3V; Lead Free: Lead Free; Max Operating Temperature: 125°C; Min Operating Temperature: -40°C; Packaging: Tape and Reel; REACH SVHC: No SVHC; Number of Transmitters: 1; Logic Function: Transceiver; Radiation Hardening: No; RoHS Compliant: Yes; Number of Drivers: 1; Contact Plating: Gold; Series: -; Number of Transceivers: 1; Case/Package: D; Package Quantity: 2500; Number of Pins: 8; Nominal Supply Current: 950uA
U5 = CMP-0314-00263-2: Low-Voltage 16-Bit I2C and SMBus I/O Expander, 16 Outputs, 1.65 to 5.5 V, -40 to 85 degC, 24-pin TSSOP (PW), Green (RoHS & no Sb/Br); Manufacturer: Texas Instruments; Reset Input: Yes; SubFamily: I2C IO Expander; I2C Address: 0100 00x; Max Frequency(kHz): 400; VCC(Min)(V): 1.65; # of I/Os: 16; VCC(Max)(V): 5.5; Mounting Technology: Surface Mount; 5V Tolerant I/O: Yes; ComponentLink1URL: http://www.ti.com/general/docs/lit/getliterature.tsp?genericPartNumber=TCA6416A&fileType=pdf; ComponentLink2URL: http://www.ti.com/litv/pdf/mpds177g; ComponentLink1Description: Datasheet; fSCLK(Max)(MHz): 400; PackageDescription: 24-Pin Thin Small Outline Package 0.65 mm Pitch; DatasheetVersion: SCPS194A; PackageReference: PW0024A; ComponentLink2Description: Package Specification; Interrupt Output: Yes; Eco-Plan: Green (RoHS & no Sb/Br); Configuration Registers: Yes; No. of Outputs: 16; Code_JEDEC: MO-153; PartNumber: TCA6416APWR; Low Power: Yes; Vcc range(V): 1.65 to 5.5; PackageVersion: revG, Feb-2011; Push-Pull I/O Type: Yes